# EAGLE design hellomax2 (EAGLE 7.2.0)
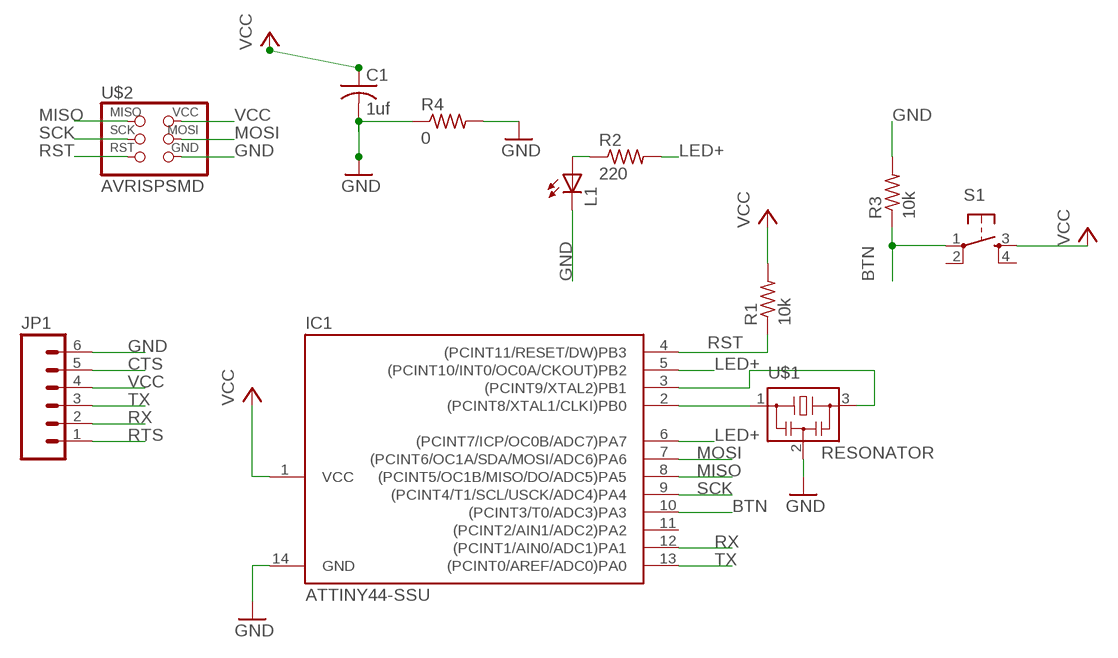
[diagram p0: schematic, sheet 1]

## Parts
C1  1uf  C-USC1206  [C1206]
IC1  ATTINY44-SSU  [SOIC14]
JP1  M06SMD  [1X06-SMD]
L1  LED1206  [1206]
R1  10k  R-US_R1206  [R1206]
R2  220  RESISTOR1206  [1206]
R3  10k  R-US_R1206  [R1206]
R4  0  RESISTOR1206  [1206]
S1  6MM_SWITCH6MM_SWITCH  [6MM_SWITCH]
U$1  RESONATOR  [EFOBM]
U$2  AVRISPSMD  [2X03SMD]

## Nets
BTN: IC1.10((PCINT3/T0/ADC3)PA3) R3.1 S1.1(P)
CTS: JP1.5
GND: C1.2 IC1.14(GND) JP1.6 L1.2(C) R3.2 R4.1 R4.2 U$1.2 U$2.6(GND)
LED+: IC1.5((PCINT10/INT0/OC0A/CKOUT)PB2) IC1.6((PCINT7/ICP/OC0B/ADC7)PA7) R2.2
MISO: IC1.8((PCINT5/OC1B/MISO/DO/ADC5)PA5) U$2.1(MISO)
MOSI: IC1.7((PCINT6/OC1A/SDA/MOSI/ADC6)PA6) U$2.4(MOSI)
N$1: IC1.2((PCINT8/XTAL1/CLKI)PB0) U$1.1
N$2: IC1.3((PCINT9/XTAL2)PB1) U$1.3
N$3: L1.1(A) R2.1
RST: IC1.4((PCINT11/RESET/DW)PB3) R1.1 U$2.5(RST)
RTS: JP1.1
RX: IC1.12((PCINT1/AIN0/ADC1)PA1) JP1.2
SCK: IC1.9((PCINT4/T1/SCL/USCK/ADC4)PA4) U$2.3(SCK)
TX: IC1.13((PCINT0/AREF/ADC0)PA0) JP1.3
VCC: C1.1 IC1.1(VCC) JP1.4 R1.2 S1.3(S) U$2.2(VCC)
Unconnected: IC1.11((PCINT2/AIN1/ADC2)PA2) S1.2(P1) S1.4(S1)

## Library data of the parts
C1 = rcl:C-US: CAPACITOR, American symbol
IC1 = fab:ATTINY44
JP1 = SparkFun:M06: Header 6 Standard 6-pin 0.1" header. Use with straight break away headers (SKU : PRT-00116), right angle break away headers (PRT-00553), swiss pins (PRT-00743), machine pins (PRT-00117), and female headers (PRT-00115). Molex polarized connector foot print use with SKU : PRT-08094 with associated crimp pins and housings. NOTES ON THE VARIANTS LOCK and LOCK_LONGPADS... This footprint was designed to help hold the alignment of a through-hole component (i.e. 6-pin header) while soldering it into place. You may notice that each hole has been shifted either up or down by 0.005 of an inch from it's more standard position (which is a perfectly straight line). This slight alteration caused the pins (the squares in the middle) to touch the edges of the holes. Because they are alternating, it causes a "brace" to hold the component in place. 0.005 has proven to be the perfect amount of "off-center" position when using our standard breakaway headers. Although looks a little odd when you look at the bare footprint, once you have a header in there, the alteration is very hard to notice. Also, if you push a header all the way into place, it is covered up entirely on the bottom side. This idea of altering the position of holes to aid alignment will be further integrated into the Sparkfun Library for other footprints. It can help hold any component with 3 or more connection pins.
L1 = 01_FAB_Hello:LED
R1 R3 = resistor:R-US_: RESISTOR, American symbol
R2 R4 = 01_FAB_Hello:RESISTOR
S1 = 01_FAB_Hello:6MM_SWITCH: OMRON SWITCH
U$1 = fab:RESONATOR
U$2 = fab:AVRISP

## Board
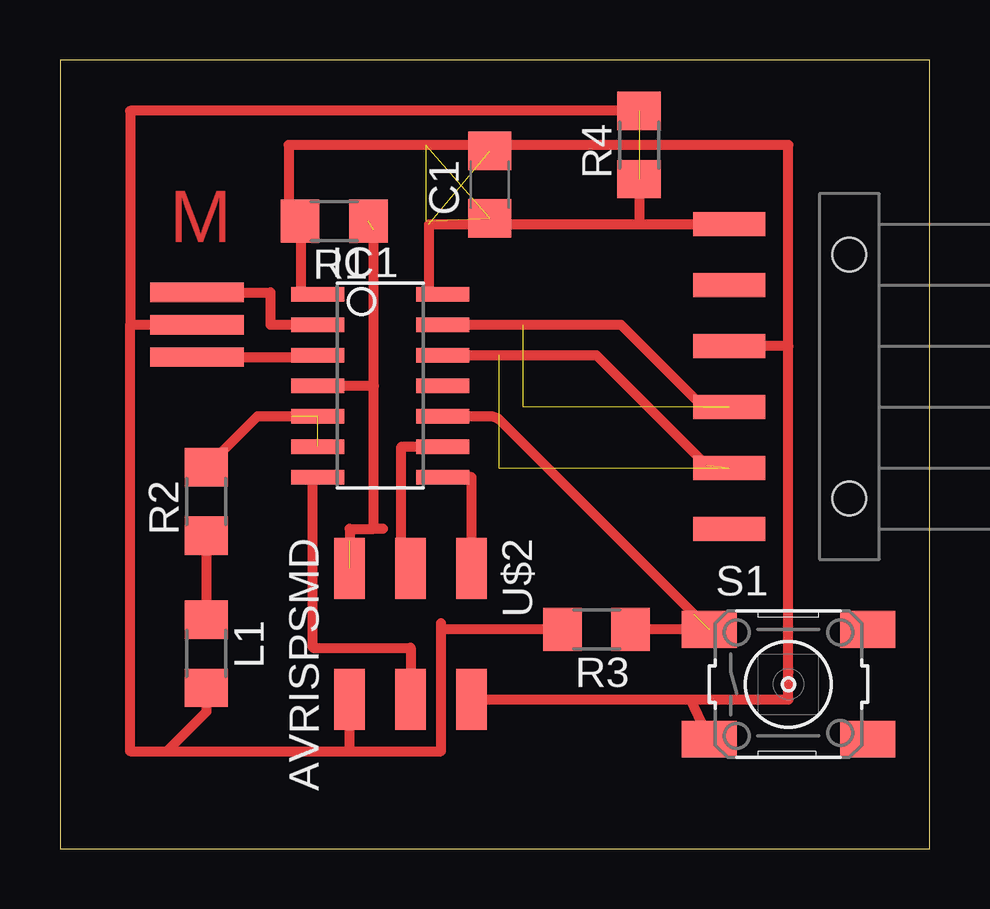
[diagram p1: board, top side]

Size 36.25 x 32.88 mm. Coordinates in mm from the lower left corner, seen from the top.
Outline: 0,0 36.25,0 36.25,32.88 0,32.88 0,0
Copper layers 1: Top 0.035mm
Design rules "ERP-1sided-10mil-16mill": minimum track width 10mil, minimum drill 24mil, track to track 16mil, track to pad 16mil, pad to pad 16mil, via to via 16mil, smd to smd 0mil, copper to edge 16mil, drill to drill 36mil, minimum pad ring 10mil, minimum via ring 8mil, stop-mask expansion 4mil, vias tented up to drill 0mil, thermal gap 10mil

### Footprints (pad centres in the part's own frame; a part is rotated, then mirrored left to right if it is on the bottom)
C1206 = smd 1.6 x 1.8: 1 -1.4,0; 2 1.4,0
SOIC14 = smd 0.61 x 2.21: 1 -3.81,-2.603; 2 -2.54,-2.603; 3 -1.27,-2.603; 4 0,-2.603; 5 1.27,-2.603; 6 2.54,-2.603; 7 3.81,-2.603; 8 3.81,2.603; 9 2.54,2.603; 10 1.27,2.603; 11 0,2.603; 12 -1.27,2.603; 13 -2.54,2.603; 14 -3.81,2.603
1X06-SMD = smd 1 x 3: 1 -6.35,5; 2 -3.81,5; 3 -1.27,5; 4 1.27,5; 5 3.81,5; 6 6.35,5 | hole 1.4: -5.08,0; 5.08,0
1206 = smd 1.6 x 1.803: 1 -1.422,0; 2 1.422,0
R1206 = smd 1.6 x 1.803: 1 -1.422,0; 2 1.422,0
6MM_SWITCH = smd 2.286 x 1.524: 1 -3.302,2.286; 2 3.302,2.286; 3 -3.302,-2.286; 4 3.302,-2.286
EFOBM = smd 0.8 x 3.9: 1 -1.35,0; 2 0,0; 3 1.35,0
2X03SMD = smd 2.54 x 1.27: 1 -2.54,2.54; 2 2.92,2.54; 3 -2.54,0; 4 2.92,0; 5 -2.54,-2.54; 6 2.92,-2.54

### Placement (x,y rotation side)
C1  17.91,27.69 90 top
IC1  13.34,19.3 270 top
JP1  32.89,19.68 90 top
L1  6.1,8.13 270 top
R1  11.43,26.16 180 top
R2  6.1,14.48 90 top
R3  22.35,9.14 180 top
R4  24.13,29.34 90 top
S1  30.35,6.86 0 top
U$1  5.71,21.84 270 top
U$2  14.61,9.14 270 top

### Tracks (layer width: path | path; a pad name or v marks a point on that pad's centre or on a via)
BTN  (1 unrouted)
  Top 0.406: S1.1 R3.1 | IC1.10 17.9,18.03 arc-45 18.35,17.85 26.42,9.78
GND  (2 unrouted)
  Top 0.406: 15.88,9.14 15.88,4.06 12.06,4.06 | 15.88,9.14 15.88,9.4 | 27.89,26.29 JP1.6 24.13,26.04 | IC1.14 15.37,23.11 15.37,26.04 24.13,26.04 | 2.92,21.84 U$1.2 | U$2.6 12.06,4.06 | 2.92,21.84 2.92,4.06 4.45,4.06 | 4.45,4.06 12.06,4.06 | L1.2 6.1,5.71 4.45,4.06 | R3.2 15.88,9.14 | R4.2 2.92,30.76 2.92,21.84 | 24.13,28.04 R4.1 24.13,26.04
LED+  (2 unrouted)
  Top 0.406: R2.2 8.23,18.03 9.65,18.03
MISO
  Top 0.406: IC1.8 17.14,15.49 U$2.1
MOSI
  Top 0.406: IC1.7 10.54,15.49 10.54,8.38 14.61,8.38 U$2.4
N$1
  Top 0.406: U$1.1 8.76,23.19 8.76,21.84 IC1.2
N$2
  Top 0.406: U$1.3 10.73,20.49 IC1.3
N$3
  Top 0.406: R2.1 L1.1
RST  (2 unrouted)
  Top 0.406: 12.45,26.16 R1.1 | U$2.5 12.45,11.68 | 13.46,13.34 13.08,13.34 | 12.06,12.83 12.06,13.34 13.08,13.34 | 13.08,13.34 13.08,19.3 | 13.08,19.3 13.08,25.78 | IC1.4 13.08,19.3
RX  (3 unrouted)
  Top 0.406: IC1.12 22.35,20.57 26.92,16
SCK
  Top 0.406: U$2.3 14.22,11.68 14.22,16.76 IC1.9
TX  (3 unrouted)
  Top 0.406: IC1.13 23.37,21.84 26.8,18.41
VCC  (3 unrouted)
  Top 0.254: 30.35,7.37 30.35,7.47
  Top 0.406: 15.24,29.34 9.53,29.34 9.53,26.16 R1.2 10.03,26.16 10.03,23.11 IC1.1 | 30.35,20.95 JP1.4 | 30.35,20.95 30.35,7.37 30.35,6.22 26.29,6.22 | 15.24,29.34 30.35,29.34 30.35,20.95 | U$2.2 26.29,6.22 | S1.3 26.29,6.22

### Text on the board
Top: M